# EAGLE design autoset-sensing (EAGLE 7.5.0)
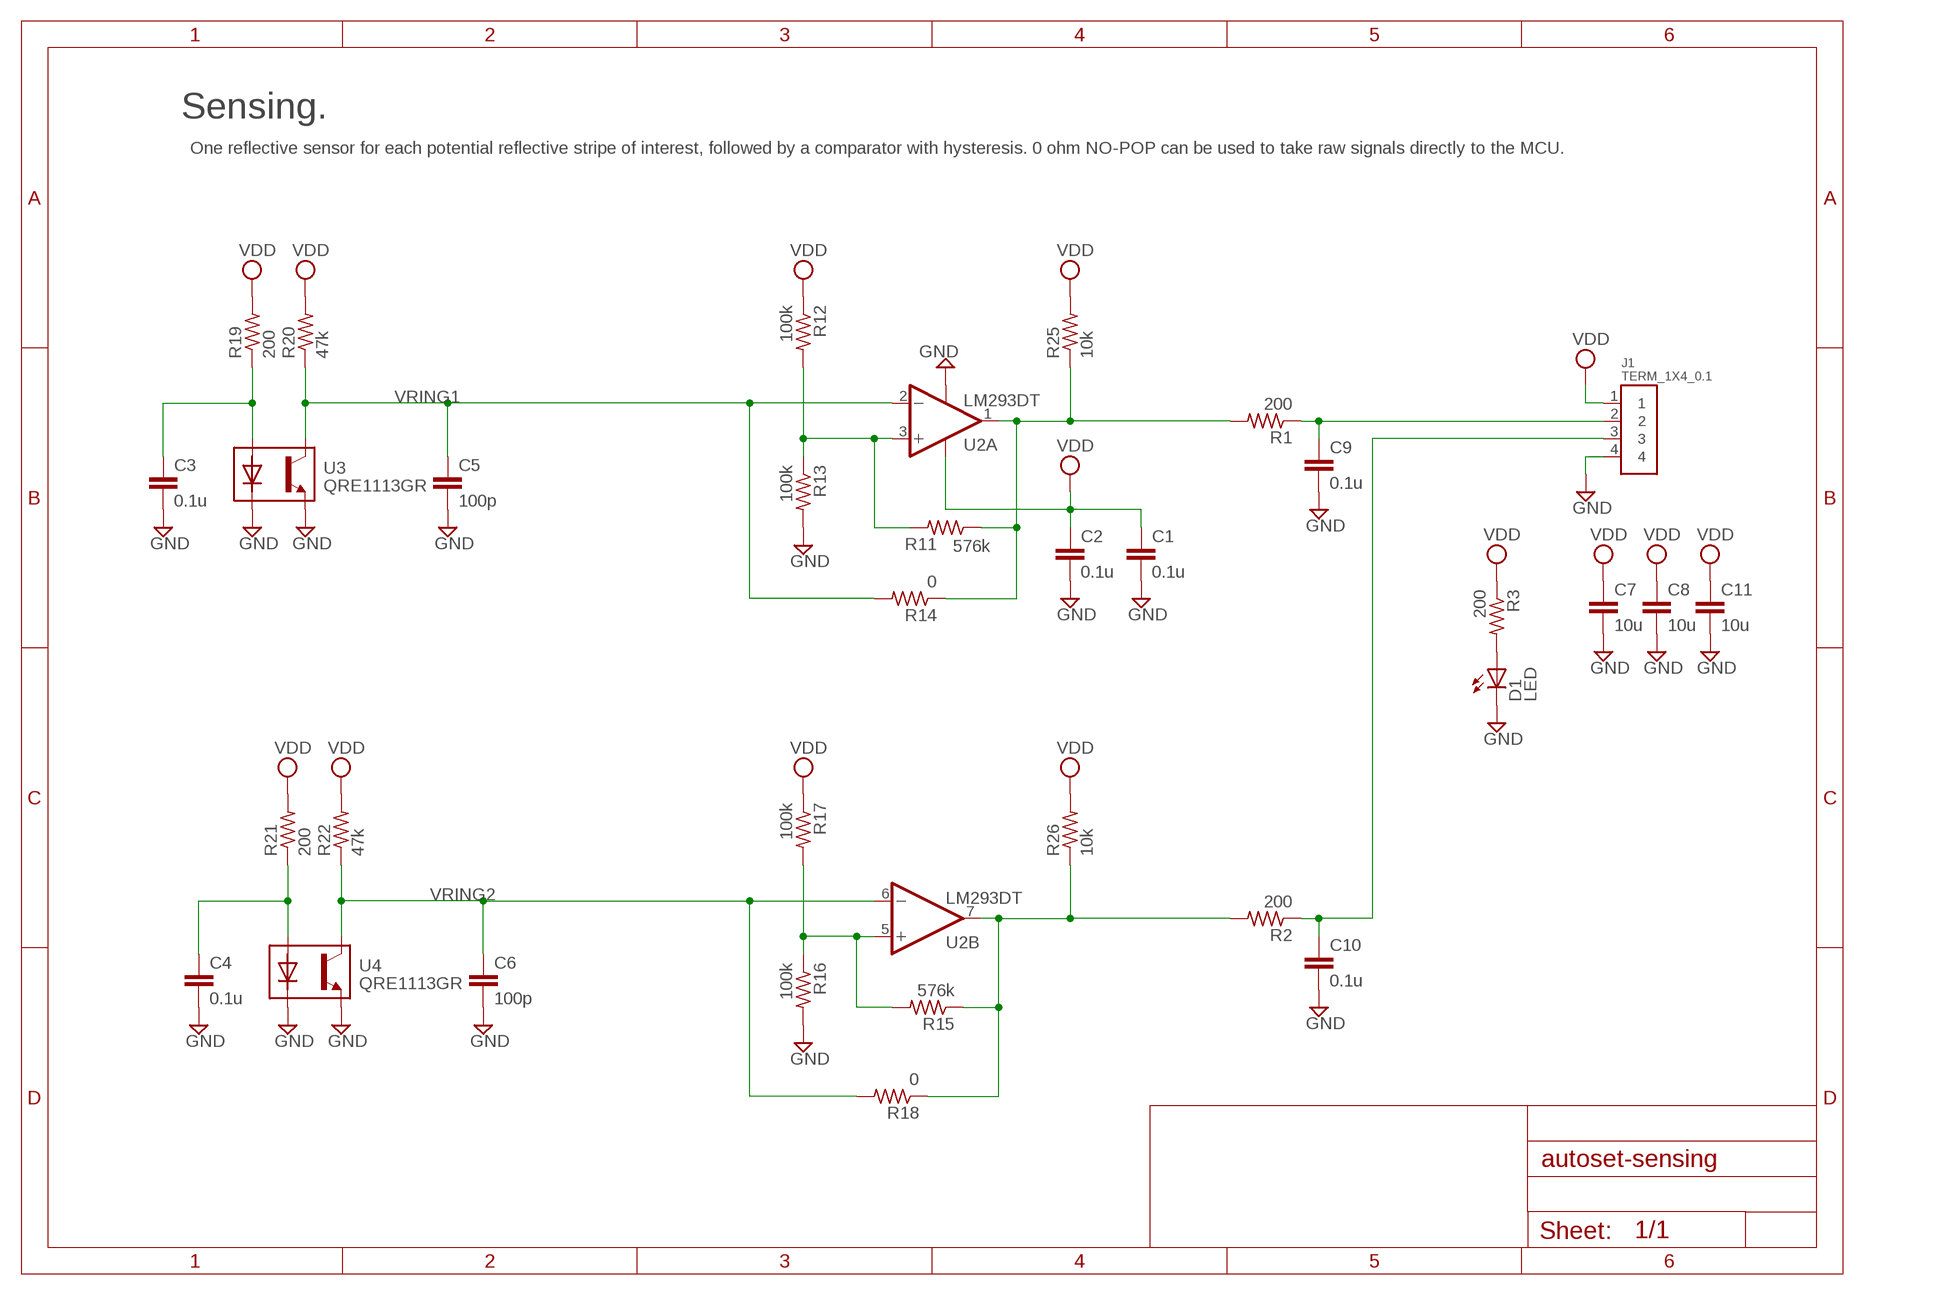
[diagram p0: schematic, sheet 1]

## Parts
C1  0.1u  C0603  [C0603]
C2  0.1u  C0603  [C0603]
C3  0.1u  C0603  [C0603]
C4  0.1u  C0603  [C0603]
C5  100p  C0603  [C0603]
C6  100p  C0603  [C0603]
C7  10u  C0603  [C0603]
C8  10u  C0603  [C0603]
C9  0.1u  C0603  [C0603]
C10  0.1u  C0603  [C0603]
C11  10u  C0603  [C0603]
D1  LED  [L0805]
J1  TERM_1X4_0.1  [TERM_1X4_0.1]
R1  200  R0603  [R0603]
R2  200  R0603  [R0603]
R3  200  R0603  [R0603]
R11  576k  R0603  [R0603]
R12  100k  R0603  [R0603]
R13  100k  R0603  [R0603]
R14  0  R0603  [R0603]
R15  576k  R0603  [R0603]
R16  100k  R0603  [R0603]
R17  100k  R0603  [R0603]
R18  0  R0603  [R0603]
R19  200  R0603  [R0603]
R20  47k  R0603  [R0603]
R21  200  R0603  [R0603]
R22  47k  R0603  [R0603]
R25  10k  R0603  [R0603]
R26  10k  R0603  [R0603]
U2  LM293DT  [SOIC8]
U3  QRE1113GR  [REFL]
U4  QRE1113GR  [REFL]

## Nets
GND: C1.2 C2.2 C3.2 C4.2 C5.2 C6.2 C7.2 C8.2 C9.2 C10.2 C11.2 D1.2(C) J1.4 R13.2 R16.2 U2.4(A:V-) U3.2(DC) U3.4(E) U4.2(DC) U4.4(E)
N$1: C9.1 J1.2 R1.1
N$2: C10.1 J1.3 R2.1
N$3: D1.1(A) R3.2
N$9: R11.2 R12.2 R13.1 U2.3(A:+IN)
N$10: R1.2 R11.1 R14.1 R25.1 U2.1(A:OUT)
N$11: C3.1 R19.1 U3.1(DA)
N$13: R15.2 R16.1 R17.2 U2.5(B:+IN)
N$14: R2.2 R15.1 R18.1 R26.1 U2.7(B:OUT)
N$15: C4.1 R21.1 U4.1(DA)
VDD: C1.1 C2.1 C7.1 C8.1 C11.1 J1.1 R3.1 R12.1 R17.1 R19.2 R20.2 R21.2 R22.2 R25.2 R26.2 U2.8(A:V+)
VRING1: C5.1 R14.2 R20.1 U2.2(A:-IN) U3.3(C)
VRING2: C6.1 R18.2 R22.1 U2.6(B:-IN) U4.3(C)

## Notes on the sheet
- Sensing.
- One reflective sensor for each potential reflective stripe of interest, followed by a comparator with hysteresis. 0 ohm NO-POP can be used to take raw signals directly to the MCU.

## Library data of the parts
C1-C4 C9 C10 = dsantoro-discrete:C; DKPN: 490-1519-1-ND
C5 C6 = dsantoro-discrete:C; DKPN: 490-4767-1-ND
C7 C8 C11 = dsantoro-discrete:C; DKPN: 490-7202-1-ND
D1 = dsantoro-discrete:LED; DKPN: 475-1410-1-ND
J1 = dsantoro-conn:TERM_1X4_0.1; DKPN: ED10563-ND
R1-R3 R19 R21 = dsantoro-discrete:R; DKPN: RHM200DCT-ND
R11 R15 = dsantoro-discrete:R; DKPN: 311-576KHRCT-ND
R12 R13 R16 R17 = dsantoro-discrete:R; DKPN: RHM100KDCT-ND
R14 R18 = dsantoro-discrete:R; DKPN: 541-2779-1-ND
R20 R22 = dsantoro-discrete:R; DKPN: RHM47KDCT-ND
R25 R26 = dsantoro-discrete:R; DKPN: RHM10KDCT-ND
U2 = dsantoro-op:LM293; DKPN: 497-1566-1-ND
U3 U4 = dsantoro-sens:QRE1113; DKPN: QRE1113GRCT-ND

## Board
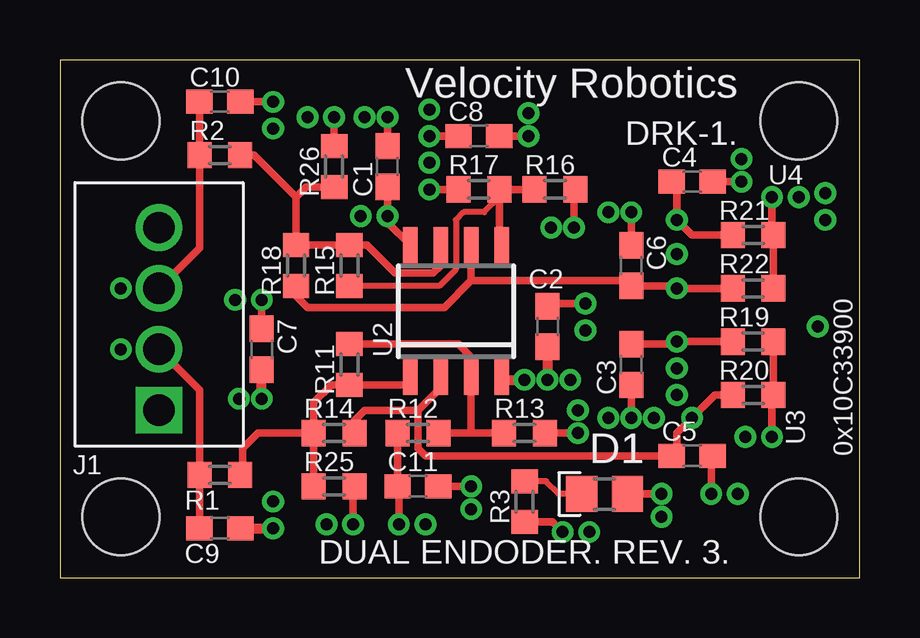
[diagram p1: board, top side]
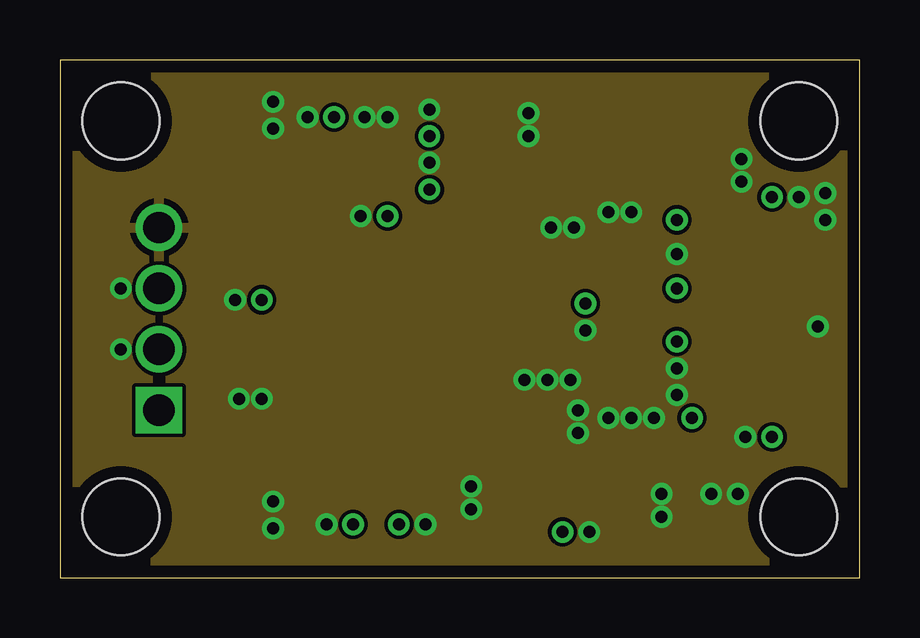
[diagram p2: board, inner layer GND]
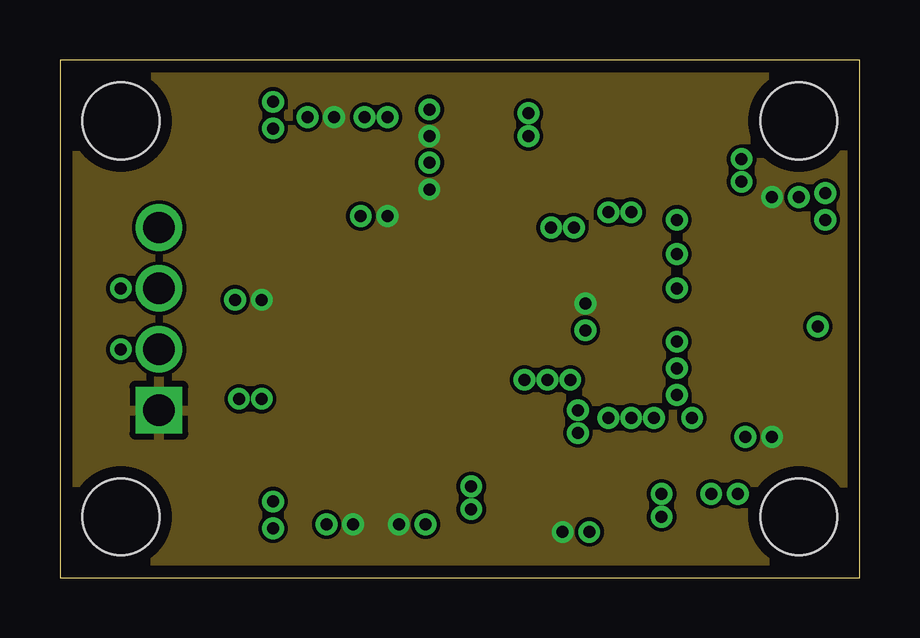
[diagram p3: board, inner layer VDD]
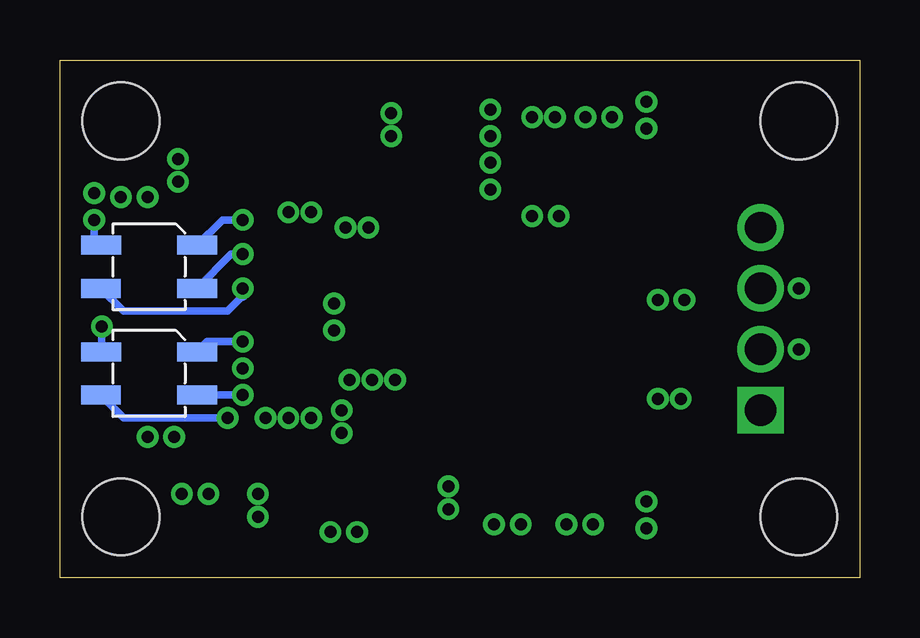
[diagram p4: board, bottom side, seen from below]

Size 33.34 x 21.59 mm. Coordinates in mm from the lower left corner, seen from the top.
Outline: 0,0 33.34,0 33.34,21.59 0,21.59 0,0
Copper layers (1+2*15+16): Top 0.0178mm / dielectric 12mil / GND 0.0356mm / dielectric 28mil / VDD 0.0356mm / dielectric 12mil / Bottom 0.0178mm
Design rules "SSC-EAGLE-4Lyr_v1.0.0.3": minimum track width 6mil, minimum drill 8mil, track to track 6mil, track to pad 6mil, pad to pad 6mil, via to via 6mil, smd to smd 6mil, copper to edge 20mil, drill to drill 16mil, minimum pad ring 8mil, minimum via ring 8mil, stop-mask expansion 3mil, vias tented up to drill 0mil, thermal gap 10mil
Holes 3.2 mm at 30.8,19.05 30.8,2.54 2.54,19.05 2.54,2.54

### Footprints (pad centres in the part's own frame; a part is rotated, then mirrored left to right if it is on the bottom)
C0603 = smd 1.1 x 1: 1 -0.85,0; 2 0.85,0
L0805 = smd 1.3 x 1.5: 1 -0.95,0; 2 0.95,0
TERM_1X4_0.1 = drill 1.3 square: 1 0,0 | drill 1.3: 2 0,-2.54; 3 0,-5.08; 4 0,-7.62
R0603 = smd 1 x 1.1: 1 -0.85,0; 2 0.85,0
SOIC8 = smd 0.6 x 1.5: 1 -1.905,-2.75; 2 -0.635,-2.75; 3 0.635,-2.75; 4 1.905,-2.75; 5 1.905,2.75; 6 0.635,2.75; 7 -0.635,2.75; 8 -1.905,2.75
REFL = smd 1.66 x 0.79: 1 0,-1.8; 2 4,-1.8; 3 4.01,0; 4 0,0

### Placement (x,y rotation side)
C1  13.65,17.14 90 top
C2  20.32,10.48 270 top
C3  23.81,8.89 270 top
C4  26.35,16.51 0 top
C5  26.35,5.08 0 top
C6  23.81,13.02 90 top
C7  8.41,9.53 270 top
C8  17.46,18.41 0 top
C9  6.67,2.06 0 top
C10  6.67,19.84 0 top
C11  14.92,3.81 0 top
D1  22.7,3.49 0 top
J1  4.13,6.99 180 top
R1  6.67,4.29 0 top
R2  6.67,17.62 0 top
R3  19.37,3.17 90 top
R11  12.06,8.89 90 top
R12  14.92,6.03 0 top
R13  19.37,6.03 0 top
R14  11.43,6.03 0 top
R15  12.06,13.02 270 top
R16  20.64,16.19 0 top
R17  17.46,16.19 0 top
R18  9.84,13.02 270 top
R19  28.89,9.84 0 top
R20  28.89,7.62 0 top
R21  28.89,14.29 0 top
R22  28.89,12.06 0 top
R25  11.43,3.81 0 top
R26  11.43,17.14 90 top
U2  16.51,11.11 0 top
U3  27.62,7.62 180 bottom
U4  27.62,12.06 180 bottom

### Tracks (layer width: path | path; a pad name or v marks a point on that pad's centre or on a via)
GND  (via drill 0.5)
  Top 0.305: C4.2 v28.42,16.51 | C6.2 v23.81,15.24 | C3.2 v23.81,6.67 | v21.59,6.03 R13.2 | v19.53,18.41 C8.2 | R16.2 21.43,15.61 v21.43,14.61 | C11.2 v17.14,3.81 | v8.89,19.84 C10.2 | C1.2 v13.65,19.21 | D1.2 v25.08,3.49 | C5.2 27.15,5.02 v27.15,3.49
  Top 0.406: v8.41,7.46 C7.2 | C2.2 v20.32,8.26 | U2.4 18.52,8.26 v19.37,8.26 | C9.2 v8.89,2.06
  Bottom 0.305: U4.2 31.75,13.9 31.91,14.05 v31.91,14.92 | U3.2 31.59,9.45 v31.59,10.48 | U4.4 26.19,13.49 v25.72,13.49 | U3.4 v25.72,7.62
  other vias: 20.48,14.61 22.86,15.24 21.59,6.99 22.86,6.67 7.46,7.46 12.7,19.21 19.53,19.37 28.42,17.46 21.27,8.26 24.77,6.67 8.89,3.17 8.89,18.73 17.14,2.86 25.08,2.54 28.26,3.49 21.91,10.32 7.3,11.59 2.54,9.53 2.54,12.06 31.91,16.03 30.8,15.88 28.57,5.87 11.11,2.22 15.24,2.22 22.07,1.91 10.32,19.21 12.54,15.08 15.4,17.3 15.4,19.53 25.72,8.73
  pour GND: 0,0 0,21.59 33.34,21.59 33.34,0
N$1
  Top 0.305: C9.1 R1.1 5.82,7.83 J1.2
N$2
  Top 0.305: C10.1 R2.1 5.82,13.76 J1.3
N$3
  Top 0.254: D1.1 20.8,3.49 20.26,4.03 R3.2
N$9
  Top 0.305: R12.2 17.14,6.03 | 17.14,6.03 R13.1 | 17.14,6.03 U2.3 17.14,9.21 16.61,9.74 R11.2
N$10
  Top 0.305: 14.6,8.04 R11.1 11.96,8.26 | R14.1 R25.1 | 11.75,8.04 11.32,8.04 10.58,7.3 R14.1 | R1.2 7.62,3.91 7.62,5.4 8.26,6.03 R14.1
  Top 0.406: U2.1 14.6,8.04 | 11.96,8.26 11.75,8.04 R11.1
N$11  (via drill 0.5)
  Top 0.305: R19.1 v25.72,9.84 25.61,9.74 C3.1
  Bottom 0.305: U3.1 27.2,9.84 v25.72,9.84
N$13
  Top 0.254: R15.2 15.82,12.17 16.51,12.86 16.51,14.92 16.83,15.24 17.68,15.24 18.31,15.88
  Top 0.305: 18.31,15.88 R17.2 | R16.1 R17.2 | U2.5 18.31,13.96 R17.2
N$14
  Top 0.305: U2.7 15.88,13.02 15.56,12.7 13.97,12.7 12.8,13.87 R15.1 R18.1 9.84,15.88 | 9.84,15.88 10.26,16.3 R26.1 | 9.84,15.88 8.1,17.62 R2.2
N$15  (via drill 0.5)
  Top 0.305: R21.1 26.35,14.29 v25.72,14.92 25.72,16.3 C4.1
  Bottom 0.305: U4.1 26.57,14.92 v25.72,14.92
VDD  (via drill 0.5)
  Top 0.305: C2.1 20.42,11.43 v21.91,11.43 | v29.69,15.88 29.69,14.34 R21.2 R22.2 | v29.69,5.87 29.69,7.56 R20.2 R19.2 | v8.41,11.59 C7.1 | R25.2 12.22,3.75 v12.22,2.22 | v14.13,2.22 14.13,3.75 C11.1 R12.1 | v20.95,1.91 20.54,2.33 R3.1 | v11.43,19.21 R26.2 | C1.1 v13.65,15.08 13.65,14.81 U2.8 | C8.1 v15.4,18.41 | R17.1 v15.4,16.19
  pour VDD: 0,21.59 33.34,21.59 33.34,0 0,0
VRING1  (via drill 0.5)
  Top 0.305: R20.1 27.3,7.62 v26.35,6.67 25.72,6.03 25.72,5.29 C5.1 15.24,5.08 14.92,5.4 14.92,6.99 | 14.92,6.99 15.88,7.94 | 14.92,6.99 12.7,6.99 12.28,6.57 R14.2
  Top 0.406: 15.88,7.94 U2.2
  Bottom 0.305: U3.3 30.68,6.67 v26.35,6.67
VRING2  (via drill 0.5)
  Top 0.305: R22.1 v25.72,12.06 25.61,12.17 C6.1 | 17.14,12.38 U2.6 | 17.14,12.38 16.03,11.27 10.32,11.27 9.84,11.75 R18.2 | 23.6,12.38 17.14,12.38
  Top 0.406: C6.1 23.6,12.38
  Bottom 0.305: U4.3 30.68,11.11 26.35,11.11 25.72,11.75
  Bottom 0.406: 25.72,11.75 v25.72,12.06

### Text on the board
tPlace: Velocity Robotics | DRK-1. | 0x10C33900 | DUAL ENDODER. REV. 3.